# Altium schematic sheet Synchronous Buck Converter.SchDoc
size A4; SheetNumber: 9; SheetTotal: 13
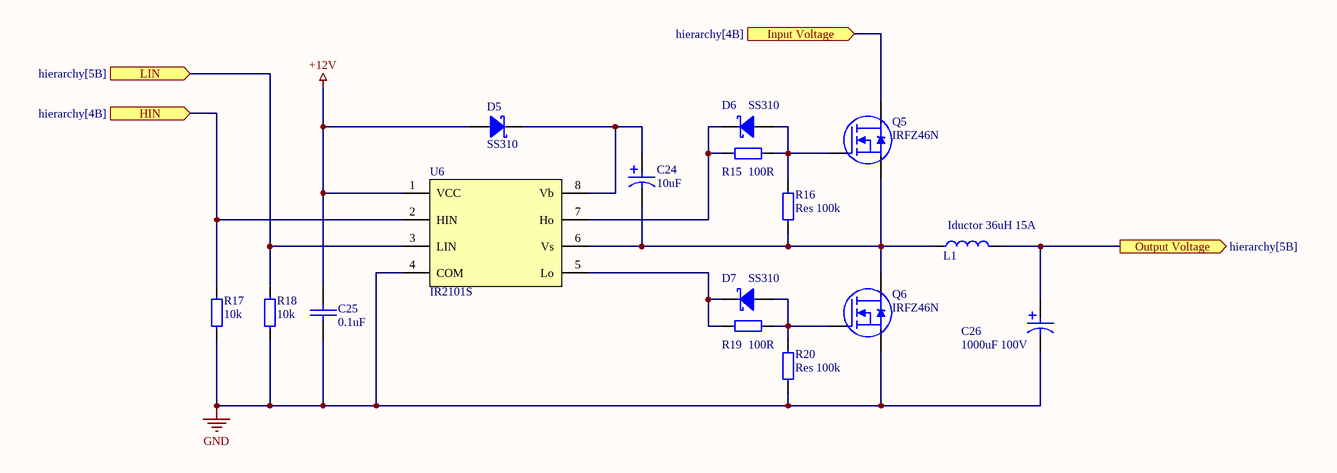
[diagram p0: Synchronous Buck Converter.SchDoc]

## Parts
C24  10uF  [Bar Cap 5x5.4]
C25  0.1uF  [0805 Capicator]
C26  1000uF 100V
D5  SS310  [DIODE: SMB]
D6  SS310  [DIODE: SMB]
D7  SS310  [DIODE: SMB]
L1  Iductor 36uH 15A
Q5  IRFZ46N  [TO220]
Q6  IRFZ46N  [TO220]
R15  100R  [0805 Resistor]
R16  Res 100k  [0805 Resistor]
R17  10k  [0805 Resistor]
R18  10k  [0805 Resistor]
R19  100R  [0805 Resistor]
R20  Res 100k  [0805 Resistor]
U6  IR2101S  [8-SOIC]

## Ports
HIN (in, see hierarchy[4B]), Input Voltage (in, see hierarchy[4B]), LIN (in, see hierarchy[5B]), Output Voltage (out, see hierarchy[5B])

## Nets
+12V: C25.2 D5.1 U6.1(VCC)
GND: C25.1 C26.1 Q6.3(Source) R17.1 R18.1 R20.1 U6.4(COM)
HIN: R17.2 U6.2(HIN) ; port HIN
Input Voltage: Q5.2(Drain) ; port Input Voltage
LIN: R18.2 U6.3(LIN) ; port LIN
Output Voltage: C26.2 L1.2 ; port Output Voltage
NetC24_1: C24.1 L1.1 Q5.3(Source) Q6.2(Drain) R16.1 U6.6(Vs)
NetC24_2: C24.2 D5.2 U6.8(Vb)
NetD6_1: D6.1 Q5.1(Gate) R15.2 R16.2
NetD6_2: D6.2 R15.1 U6.7(Ho)
NetD7_1: D7.1 Q6.1(Gate) R19.2 R20.2
NetD7_2: D7.2 R19.1 U6.5(Lo)

## Library data of the parts
C24 = Cap Pol 10uF: ECAP SMD,  35V; Part Number: ECAPSMD10uF/35V; Manufacturer: China; Type: Capacitor; ComponentLink1Description: Chip&Dip; ComponentLink1URL: https://www.chipdip.ru/product0/884555856
C25 = Cap 0.1uF (0805): 0.1uF X7R 25V 10% 0805; Manufacturer: Murata Manufacturing; Part Number: GRM21BR71E104KA01L; Type: Capacitor; ComponentLink1Description: Chip&Dip; ComponentLink1URL: https://www.chipdip.ru/product/grm21br71e104ka01l
C26 = Capacitor 1000uF 100V: 1000мкФ, 100В, 105°C, 20%, 18*40мм P:7,5мм; ComponentLink1Description: Buy; ComponentLink1URL: https://www.chipdip.ru/product0/9000565922
D5-D7 = Schottky diode SS310: 100B 3.0A Schottky diode; ComponentLink1Description: Buy; ComponentLink1URL: https://radioremont.com/product/diod-ss310-k181-17/#/overview/; Type: Diode; ComponentLink2Description: Datasheet; ComponentLink2URL: https://radioremont.com/wa-data/public/shop/products/99/92/9299/attachments/SS32%20–%20SS310.pdf
L1 = Iductor 36uH 15A: Handmade inductor 36uH
Q5 Q6 = MOSFET-N IRFZ46N: MOSFT 55V 46A 16.5mOhm 48nC; ComponentLink1Description: Buy; ComponentLink1URL: https://radioremont.com/product/tranzistor-irfz46n-k900-11/#/discount-tab/; ComponentLink2Description: Datasheet; ComponentLink2URL: https://www.quartz1.com/price/PIC/415N0072900.pdf
R15 R19 = Res 100R (0805): 0.125W 0805 100R, 1%; Part Number: RC0805FR-07100RL; Manufacturer: Taiwan; Type: Resistor; ComponentLink1Description: Chip&Dip; ComponentLink1URL: https://www.chipdip.ru/product0/9000079462
R16 R20 = Res 100k (0805): 0.125W 0805 100k, 1%; Part Number: RC0805FR-07100KL; Manufacturer: Taiwan; Type: Resistor; ComponentLink1Description: Chip&Dip; ComponentLink1URL: https://www.chipdip.ru/product0/9000079538
R17 R18 = Res 10k (0805): 0.125W 0805 10k, 1%; Part Number: RC0805FR-0710KL; Manufacturer: Taiwan; Type: Resistor; ComponentLink1Description: Chip&Dip; ComponentLink1URL: https://www.chipdip.ru/product0/9000079514
U6 = MOSFET Driver IR2101S: High and Low side driver. SOIC8 case; Type: IC; ComponentLink1Description: Buy; ComponentLink1URL: https://radioremont.com/product/mikroskhema-ir2111s-k200-7/; ComponentLink2Description: Datasheet; ComponentLink2URL: https://www.infineon.com/dgdl/Infineon-ir2101-DS-v01_00-EN.pdf?fileId=5546d462533600a4015355c7a755166c